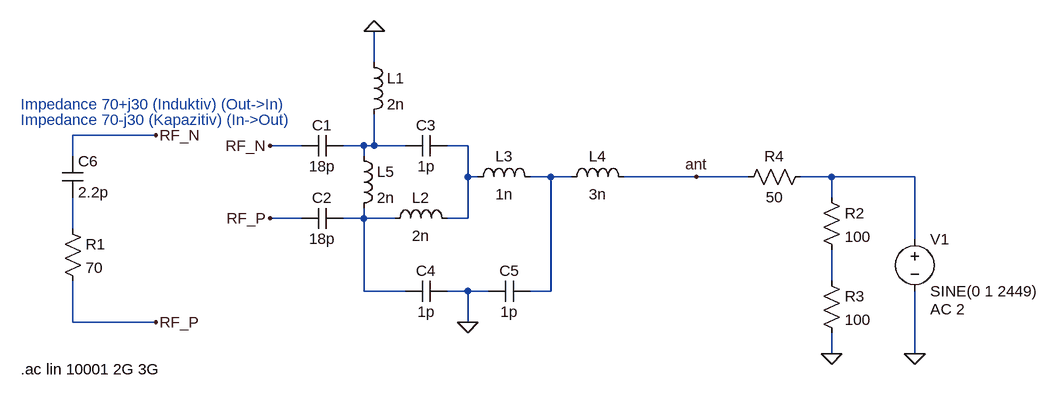
[diagram p0: schematic Antenne_2.4GHz_4.asc]
Antenne_2.4GHz_4.asc, the LTspice schematic file:
Version 4
SHEET 1 1200 680
WIRE 176 0 176 -48
WIRE -160 112 -288 112
WIRE 64 128 16 128
WIRE 160 128 128 128
WIRE 176 128 176 80
WIRE 176 128 160 128
WIRE 224 128 176 128
WIRE 320 128 288 128
WIRE -288 144 -288 112
WIRE 160 144 160 128
WIRE 320 176 320 128
WIRE 336 176 320 176
WIRE 448 176 416 176
WIRE 480 176 448 176
WIRE 672 176 560 176
WIRE 752 176 672 176
WIRE 880 176 832 176
WIRE 1008 176 880 176
WIRE 880 208 880 176
WIRE 64 240 16 240
WIRE 160 240 160 224
WIRE 160 240 128 240
WIRE 208 240 160 240
WIRE 320 240 320 176
WIRE 320 240 288 240
WIRE -288 256 -288 208
WIRE 1008 272 1008 176
WIRE 880 336 880 288
WIRE 160 352 160 240
WIRE 224 352 160 352
WIRE 320 352 288 352
WIRE 352 352 320 352
WIRE 448 352 448 176
WIRE 448 352 416 352
WIRE -288 400 -288 336
WIRE -160 400 -288 400
WIRE 320 400 320 352
WIRE 880 448 880 416
WIRE 1008 448 1008 352
FLAG 176 -48 0
FLAG 16 128 RF_N
FLAG 16 240 RF_P
FLAG 672 176 ant
FLAG -160 112 RF_N
FLAG -160 400 RF_P
FLAG 320 400 0
FLAG 880 448 0
FLAG 1008 448 0
SYMBOL cap 128 112 R90
WINDOW 0 0 32 VBottom 2
WINDOW 3 32 32 VTop 2
SYMATTR InstName C1
SYMATTR Value 18p
SYMBOL cap 128 224 R90
WINDOW 0 0 32 VBottom 2
WINDOW 3 32 32 VTop 2
SYMATTR InstName C2
SYMATTR Value 18p
SYMBOL cap 288 112 R90
WINDOW 0 0 32 VBottom 2
WINDOW 3 32 32 VTop 2
SYMATTR InstName C3
SYMATTR Value 1p
SYMBOL ind 160 -16 R0
SYMATTR InstName L1
SYMATTR Value 2n
SYMBOL ind 192 256 R270
WINDOW 0 32 56 VTop 2
WINDOW 3 5 56 VBottom 2
SYMATTR InstName L2
SYMATTR Value 2n
SYMBOL ind 320 192 R270
WINDOW 0 32 56 VTop 2
WINDOW 3 5 56 VBottom 2
SYMATTR InstName L3
SYMATTR Value 1n
SYMBOL ind 464 192 R270
WINDOW 0 32 56 VTop 2
WINDOW 3 5 56 VBottom 2
SYMATTR InstName L4
SYMATTR Value 3n
SYMBOL cap 288 336 R90
WINDOW 0 0 32 VBottom 2
WINDOW 3 32 32 VTop 2
SYMATTR InstName C4
SYMATTR Value 1p
SYMBOL cap 416 336 R90
WINDOW 0 0 32 VBottom 2
WINDOW 3 32 32 VTop 2
SYMATTR InstName C5
SYMATTR Value 1p
SYMBOL cap -304 144 R0
SYMATTR InstName C6
SYMATTR Value 2.2p
SYMBOL res 864 192 R0
SYMATTR InstName R2
SYMATTR Value 100
SYMBOL res 864 320 R0
SYMATTR InstName R3
SYMATTR Value 100
SYMBOL voltage 1008 256 R0
WINDOW 123 24 124 Left 2
WINDOW 39 0 0 Left 2
SYMATTR Value2 AC 2
SYMATTR InstName V1
SYMATTR Value SINE(0 1 2449)
SYMBOL res 848 160 R90
WINDOW 0 0 56 VBottom 2
WINDOW 3 32 56 VTop 2
SYMATTR InstName R4
SYMATTR Value 50
SYMBOL res -304 240 R0
SYMATTR InstName R1
SYMATTR Value 70
SYMBOL ind 144 128 R0
SYMATTR InstName L5
SYMATTR Value 2n
TEXT -368 64 Left 2 ;Impedance 70+j30 (Induktiv) (Out->In)
TEXT -368 88 Left 2 ;Impedance 70-j30 (Kapazitiv) (In->Out)
TEXT -368 472 Left 2 !.ac lin 10001 2G 3G

The netlist it stands for:
* Antenne_2.4GHz_4.asc
C1 N001 RF_N 18p
C2 N005 RF_P 18p
C3 N002 N001 1p
L1 0 N001 2n
L2 N005 N002 2n
L3 N002 N003 1n
L4 N003 ant 3n
C4 0 N005 1p
C5 N003 0 1p
C6 RF_N N006 2.2p
R2 N004 N007 100
R3 N007 0 100
V1 N004 0 SINE(0 1 2449) AC 2
R4 N004 ant 50
R1 N006 RF_P 70
L5 N001 N005 2n
* Impedance 70+j30 (Induktiv) (Out->In)
* Impedance 70-j30 (Kapazitiv) (In->Out)
.ac lin 10001 2G 3G
.backanno
.end